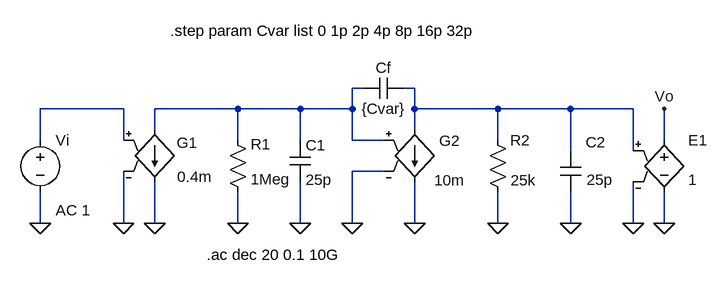
[diagram p0: schematic Ej 2_ Compensacion.asc]
Ej 2_ Compensacion.asc, the LTspice schematic file:
Version 4
SHEET 1 884 680
WIRE 352 128 336 128
WIRE 432 128 416 128
WIRE -16 160 -144 160
WIRE 160 160 32 160
WIRE 256 160 160 160
WIRE 336 160 336 128
WIRE 336 160 256 160
WIRE 432 160 432 128
WIRE 560 160 432 160
WIRE 672 160 560 160
WIRE 768 160 672 160
WIRE 32 192 32 160
WIRE 432 192 432 160
WIRE -144 208 -144 160
WIRE -16 208 -16 160
WIRE 160 208 160 160
WIRE 256 208 256 160
WIRE 336 208 336 160
WIRE 384 208 336 208
WIRE 560 208 560 160
WIRE 816 208 816 160
WIRE 672 224 672 160
WIRE 768 224 768 160
WIRE 384 256 336 256
WIRE -144 336 -144 288
WIRE -16 336 -16 256
WIRE 32 336 32 272
WIRE 160 336 160 288
WIRE 256 336 256 272
WIRE 336 336 336 256
WIRE 432 336 432 272
WIRE 560 336 560 288
WIRE 672 336 672 288
WIRE 768 336 768 272
WIRE 816 336 816 288
FLAG -144 336 0
FLAG 256 336 0
FLAG 336 336 0
FLAG 560 336 0
FLAG 672 336 0
FLAG 432 336 0
FLAG 32 336 0
FLAG -16 336 0
FLAG 160 336 0
FLAG 816 336 0
FLAG 768 336 0
FLAG 816 160 Vo
SYMBOL voltage -144 192 R0
WINDOW 123 24 124 Left 2
WINDOW 39 0 0 Left 0
SYMATTR Value2 AC 1
SYMATTR InstName Vi
SYMATTR Value ""
SYMBOL g2 432 288 M180
WINDOW 0 38 79 Left 2
WINDOW 3 30 18 Left 2
SYMATTR InstName G2
SYMATTR Value 10m
SYMBOL cap 416 112 R90
WINDOW 0 0 32 VBottom 2
WINDOW 3 32 32 VTop 2
SYMATTR InstName Cf
SYMATTR Value {Cvar}
SYMBOL cap 240 208 R0
WINDOW 3 24 61 Left 2
SYMATTR InstName C1
SYMATTR Value 25p
SYMBOL res 544 192 R0
WINDOW 0 35 16 Left 2
WINDOW 3 36 78 Left 2
SYMATTR InstName R2
SYMATTR Value 25k
SYMBOL cap 656 224 R0
WINDOW 0 39 -13 Left 2
WINDOW 3 41 45 Left 2
SYMATTR InstName C2
SYMATTR Value 25p
SYMBOL res 144 192 R0
WINDOW 0 36 22 Left 2
SYMATTR InstName R1
SYMATTR Value 1Meg
SYMBOL e 816 192 R0
WINDOW 0 37 16 Left 2
WINDOW 3 37 77 Left 2
SYMATTR InstName E1
SYMATTR Value 1
SYMBOL g2 32 288 M180
WINDOW 0 34 76 Left 2
WINDOW 3 35 24 Left 2
SYMATTR InstName G1
SYMATTR Value 0.4m
TEXT 112 384 Left 2 !.ac dec 20 0.1 10G
TEXT 56 40 Left 2 !.step param Cvar list 0 1p 2p 4p 8p 16p 32p

The netlist it stands for:
* Ej 2_ Compensacion.asc
Vi N003 0 AC 1
G2 N002 0 N001 0 10m
Cf N002 N001 {Cvar}
C1 N001 0 25p
R2 N002 0 25k
C2 N002 0 25p
R1 N001 0 1Meg
E1 Vo 0 N002 0 1
G1 N001 0 N003 0 0.4m
.ac dec 20 0.1 10G
.step param Cvar list 0 1p 2p 4p 8p 16p 32p
.backanno
.end